# EAGLE design untitled (EAGLE 9.6.2)
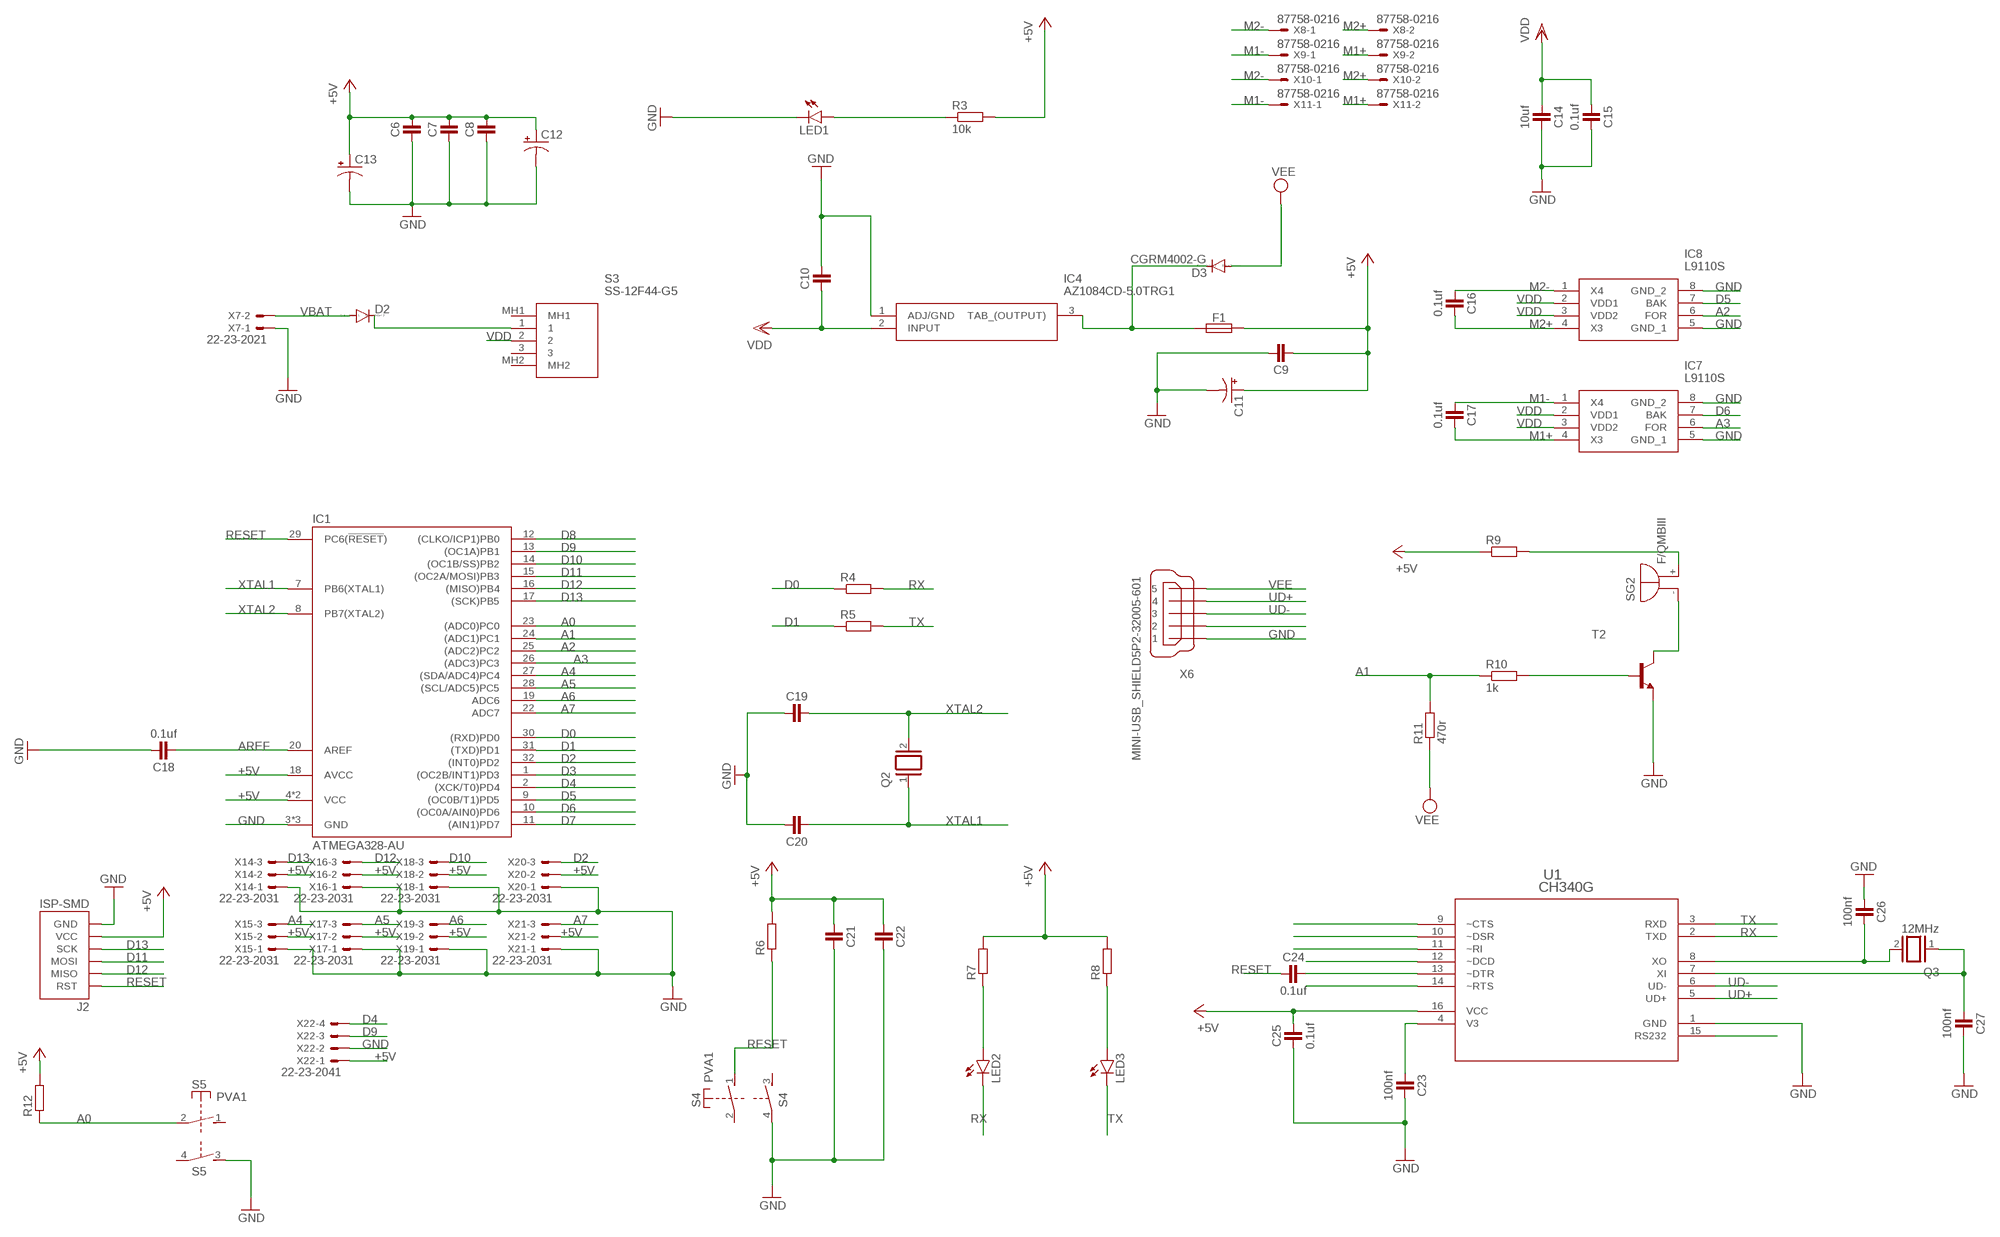
[diagram p0: schematic, sheet 1]

## Parts
C6  CAPACITOR-0603  [C0603]
C7  CAPACITOR-0603  [C0603]
C8  CAPACITOR-0603  [C0603]
C9  CAPACITOR-0603  [C0603]
C10  CAPACITOR-0603  [C0603]
C11  CPOL-USB/3528-21R  [B/3528-21R]
C12  CPOL-USB/3528-21R  [B/3528-21R]
C13  CPOL-USB/3528-21R  [B/3528-21R]
C14  10uf  CAPACITOR-0603  [C0603]
C15  0.1uf  CAPACITOR-0603  [C0603]
C16  0.1uf  CAPACITOR-0603  [C0603]
C17  0.1uf  CAPACITOR-0603  [C0603]
C18  0.1uf  CAPACITOR-0603  [C0603]
C19  CAPACITOR-0603  [C0603]
C20  CAPACITOR-0603  [C0603]
C21  CAPACITOR-0603  [C0603]
C22  CAPACITOR-0603  [C0603]
C23  100nf  CAPACITOR-0603  [C0603]
C24  0.1uf  CAPACITOR-0603  [C0603]
C25  0.1uf  CAPACITOR-0603  [C0603]
C26  100nf  CAPACITOR-0603  [C0603]
C27  100nf  CAPACITOR-0603  [C0603]
D2  DIODE-DO-214AC  [DO-214AC]
D3  CGRM4002-G  [SOD-123_MINI-SMA]
F1  FUSE-1812  [C1812]
IC1  ATMEGA328-AU  [TQFP32]
IC4  AZ1084CD-5.0TRG1  [TO-252_1]
IC7  L9110S  [SOIC127P600X175-8N]
IC8  L9110S  [SOIC127P600X175-8N]
J2  ISP-SMD  [ISP-2X3_SMD]
LED1  LEDCHIPLED_0805  [CHIPLED_0805]
LED2  LEDCHIPLED_0805  [CHIPLED_0805]
LED3  LEDCHIPLED_0805  [CHIPLED_0805]
Q2  XTAL/S  [QS]
Q3  12MHz  XTAL/S  [QS]
R3  10k  R-EU_R0603  [R0603]
R4  R-EU_R0603  [R0603]
R5  R-EU_R0603  [R0603]
R6  R-EU_R0603  [R0603]
R7  R-EU_R0603  [R0603]
R8  R-EU_R0603  [R0603]
R9  R-EU_R0603  [R0603]
R10  1k  R-EU_R0603  [R0603]
R11  470r  R-EU_R0603  [R0603]
R12  R-EU_R0603  [R0603]
S3  SS-12F44-G5  [SS12F44G5]
S4  PVA1  [PVA1F]
S5  PVA1  [PVA1F]
SG2  F/QMBIII  [F/QMBIII]
T2  BC817-NPN-SOT23-BEC  [SOT23-BEC]
U1  CH340G  [SOP16-50-062A]
X6  MINI-USB_SHIELD5P2-32005-601  [32005-601]
X7  22-23-2021  [22-23-2021]
X8  87758-0216  [87758-0216]
X9  87758-0216  [87758-0216]
X10  87758-0216  [87758-0216]
X11  87758-0216  [87758-0216]
X14  22-23-2031  [22-23-2031]
X15  22-23-2031  [22-23-2031]
X16  22-23-2031  [22-23-2031]
X17  22-23-2031  [22-23-2031]
X18  22-23-2031  [22-23-2031]
X19  22-23-2031  [22-23-2031]
X20  22-23-2031  [22-23-2031]
X21  22-23-2031  [22-23-2031]
X22  22-23-2041  [22-23-2041]

## Nets
+5V: C6.2 C7.2 C8.2 C9.1 C11.+ C12.+ C13.+ C21.1 C22.1 C25.2 F1.2 IC1.4(VCC) IC1.6(VCC) IC1.18(AVCC) J2.VCC R3.2 R6.2 R7.2 R8.2 R9.1 R12.2 U1.16(VCC) X14.2 X15.2 X16.2 X17.2 X18.2 X19.2 X20.2 X21.2 X22.1
A0: IC1.23((ADC0)PC0) R12.1 S5.2(1:P)
A1: IC1.24((ADC1)PC1) R10.1 R11.2
A2: IC1.25((ADC2)PC2) IC8.6(FOR)
A3: IC1.26((ADC3)PC3) IC7.6(FOR)
A4: IC1.27((SDA/ADC4)PC4) X15.3
A5: IC1.28((SCL/ADC5)PC5) X17.3
A6: IC1.19(ADC6) X19.3
A7: IC1.22(ADC7) X21.3
AREF: C18.1 IC1.20(AREF)
D0: IC1.30((RXD)PD0) R4.1
D1: IC1.31((TXD)PD1) R5.1
D2: IC1.32((INT0)PD2) X20.3
D3: IC1.1((OC2B/INT1)PD3)
D4: IC1.2((XCK/T0)PD4) X22.4
D5: IC1.9((OC0B/T1)PD5) IC8.7(BAK)
D6: IC1.10((OC0A/AIN0)PD6) IC7.7(BAK)
D7: IC1.11((AIN1)PD7)
D8: IC1.12((CLKO/ICP1)PB0)
D9: IC1.13((OC1A)PB1) X22.3
D10: IC1.14((OC1B/SS)PB2) X18.3
D11: IC1.15((OC2A/MOSI)PB3) J2.MOSI
D12: IC1.16((MISO)PB4) J2.MISO X16.3
D13: IC1.17((SCK)PB5) J2.SCK X14.3
GND: C6.1 C7.1 C8.1 C9.2 C10.2 C11.- C12.- C13.- C14.2 C15.2 C18.2 C19.1 C20.2 C21.2 C22.2 C23.2 C25.1 C26.1 C27.2 IC1.3(GND) IC1.5(GND) IC1.21(GND) IC4.1(ADJ/GND) IC7.5(GND_1) IC7.8(GND_2) IC8.5(GND_1) IC8.8(GND_2) J2.GND LED1.C S4.4(2:P) S5.3(2:S) T2.E U1.1(GND) X6.1 X7.1 X14.1 X15.1 X16.1 X17.1 X18.1 X19.1 X20.1 X21.1 X22.2
M1+: C17.2 IC7.4(X3) X9.2 X11.2
M1-: C17.1 IC7.1(X4) X9.1 X11.1
M2+: C16.2 IC8.4(X3) X8.2 X10.2
M2-: C16.1 IC8.1(X4) X8.1 X10.1
N$1: LED1.A R3.1
N$2: D2.C S3.1
N$3: D3.C F1.1 IC4.3(TAB_(OUTPUT))
N$4: U1.15(RS232)
N$5: LED2.A R7.1
N$6: LED3.A R8.1
N$7: C27.1 Q3.1 U1.7(XI)
N$8: R9.2 SG2.+(-)
N$9: X6.2
N$10: SG2.-(+) T2.C
N$11: R10.2 T2.B
N$12: C26.2 Q3.2 U1.8(XO)
N$15: U1.9(~CTS)
N$16: U1.10(~DSR)
N$17: U1.11(~RI)
N$18: U1.12(~DCD)
N$19: C24.2 U1.13(~DTR)
N$20: U1.14(~RTS)
N$22: C23.1 U1.4(V3)
RESET: C24.1 IC1.29(PC6(!RESET!)) J2.RST R6.1 S4.1(1:S)
RX: LED2.C R4.2 U1.2(TXD)
TX: LED3.C R5.2 U1.3(RXD)
UD+: U1.5(UD+) X6.4
UD-: U1.6(UD-) X6.3
VBAT: D2.A X7.2
VDD: C10.1 C14.1 C15.1 IC4.2(INPUT) IC7.2(VDD1) IC7.3(VDD2) IC8.2(VDD1) IC8.3(VDD2) S3.2
VEE: D3.A R11.1 X6.5
XTAL1: C20.1 IC1.7(PB6(XTAL1)) Q2.1
XTAL2: C19.2 IC1.8(PB7(XTAL2)) Q2.2
Unconnected: S3.3 S3.MH1 S3.MH2 S4.2(1:P) S4.3(2:S) S5.1(1:S) S5.4(2:P) X6.M1(S1) X6.M2(S2)

## Library data of the parts
C6-C10 C14-C27 = we-rcl:CAPACITOR: Capacitors ...2.2uF @ 6.3V -> 0402 ...4.7uF @ 6.3V -> 0603 ...10uF @ 16V -> 0805 ...22uF @ 25V -> 1206
C11-C13 = rcl:CPOL-US: POLARIZED CAPACITOR, American symbol; SPICEPREFIX: C
D2 = diode:DIODE-: DIODE
D3 = diode:CGRM400*-G: Molded plasitc,JEDEC SOD-123/Mini SMA Source: Comchip CGRM4001-G.pdf
F1 = we-rcl:FUSE: Fuses
IC1 = we-chip:ATMEGA328: Atmel ATmega48/88/168/328 AVR Microcontroller
IC4 = AZ1084CD-5.0TRG1:AZ1084CD-5.0TRG1: LDO Voltage Regulators LDO BJT HiCurr Source: Datasheet <https://www.diodes.com/assets/Datasheets/AZ1084C.pdf>; ARROW_PART_NUMBER: AZ1084CD-5.0TRG1; ARROW_PRICE-STOCK: https://www.arrow.com/en/products/az1084cd-5.0trg1/diodes-incorporated; DESCRIPTION: LDO Voltage Regulators LDO BJT HiCurr; HEIGHT: mm; MANUFACTURER_NAME: Diodes Inc.; MANUFACTURER_PART_NUMBER: AZ1084CD-5.0TRG1; MOUSER_PART_NUMBER: 621-AZ1084CD-5.0TRG1; MOUSER_PRICE-STOCK: https://www.mouser.co.uk/ProductDetail/Diodes-Incorporated/AZ1084CD-50TRG1?qs=5V6w%252Be2aIqY1QaMHWnvTJw%3D%3D
IC7 IC8 = L9110S:L9110S: Motor Drivers SOP-8_150mil RoHS Source: Datasheet <https://datasheet.lcsc.com/szlcsc/Wuxi-Zhongwei-Aisin-Elec-L9110S_C85174.pdf>; DESCRIPTION: Motor Drivers SOP-8_150mil RoHS; HEIGHT: 1.75mm; MANUFACTURER_NAME: Wuxi I-core Elec; MANUFACTURER_PART_NUMBER: L9110S
J2 = we-board:ISP: AVR ISP connector
LED1-LED3 = led:LED: LED OSRAM: - CHIPLED LG R971, LG N971, LY N971, LG Q971, LY Q971, LO R971, LY R971 LH N974, LH R974 LS Q976, LO Q976, LY Q976 LO Q996 - Hyper CHIPLED LW Q18S LB Q993, LB Q99A, LB R99A - SideLED LS A670, LO A670, LY A670, LG A670, LP A670 LB A673, LV A673, LT A673, LW A673 LH A674 LY A675 LS A676, LA A676, LO A676, LY A676, LW A676 LS A679, LY A679, LG A679 - Hyper Micro SIDELED® LS Y876, LA Y876, LO Y876, LY Y876 LT Y87S - SmartLED LW L88C, LW L88S LB L89C, LB L89S, LG L890 LS L89K, LO L89K, LY L89K LS L896, LA L896, LO L896, LY L896 - TOPLED LS T670, LO T670, LY T670, LG T670, LP T670 LSG T670, LSP T670, LSY T670, LOP T670, LYG T670 LG T671, LOG T671, LSG T671 LB T673, LV T673, LT T673, LW T673 LH T674 LS T676, LA T676, LO T676, LY T676, LB T676, LH T676, LSB T676, LW T676 LB T67C, LV T67C, LT T67C, LS T67K, LO T67K, LY T67K, LW E67C LS E67B, LA E67B, LO E67B, LY E67B, LB E67C, LV E67C, LT E67C LW T67C LS T679, LY T679, LG T679 LS T770, LO T770, LY T770, LG T770, LP T770 LB T773, LV T773, LT T773, LW T773 LH T774 LS E675, LA E675, LY E675, LS T675 LS T776, LA T776, LO T776, LY T776, LB T776 LHGB T686 LT T68C, LB T68C - Hyper Mini TOPLED® LB M676 - Mini TOPLED Santana® LG M470 LS M47K, LO M47K, LY M47K Source: http://www.osram.convergy.de LUXEON: - LUMILED® LXK2-PW12-R00, LXK2-PW12-S00, LXK2-PW14-U00, LXK2-PW14-V00 LXK2-PM12-R00, LXK2-PM12-S00, LXK2-PM14-U00 LXK2-PE12-Q00, LXK2-PE12-R00, LXK2-PE12-S00, LXK2-PE14-T00, LXK2-PE14-U00 LXK2-PB12-K00, LXK2-PB12-L00, LXK2-PB12-M00, LXK2-PB14-N00, LXK2-PB14-P00, LXK2-PB14-Q00 LXK2-PR12-L00, LXK2-PR12-M00, LXK2-PR14-Q00, LXK2-PR14-R00 LXK2-PD12-Q00, LXK2-PD12-R00, LXK2-PD12-S00 LXK2-PH12-R00, LXK2-PH12-S00 LXK2-PL12-P00, LXK2-PL12-Q00, LXK2-PL12-R00 Source: www.luxeon.com KINGBRIGHT: KA-3528ASYC Source: www.kingbright.com
Q2 Q3 = special:XTAL/S: CRYSTAL
R3-R12 = rcl:R-EU_: RESISTOR, European symbol; SPICEPREFIX: R
S3 = SS-12F44-G5:SS-12F44-G5: Toggle Switches Plugin RoHS Source: Datasheet <https://datasheet.lcsc.com/szlcsc/Korean-Hroparts-Elec-SS-12F44-G5_C136718.pdf>; DESCRIPTION: Toggle Switches Plugin RoHS; HEIGHT: 11mm; MANUFACTURER_NAME: Korean Hroparts Elec; MANUFACTURER_PART_NUMBER: SS-12F44-G5
S4 S5 = switch-misc:PVA1: ITT SWITCH
SG2 = buzzer:F/QMBIII: BUZZER Source: Buerklin; OC_FARNELL: unknown; OC_NEWARK: unknown
T2 = transistor-neu-to92:*-NPN-: NPN Transistror
U1 = ch340g:CH340G; CHCODE: INTUP000002; DESIGNER: CHIPHOME; DEVICE: CH340G; FOOTPRINT: sop16-50-062a
X6 = con-cypressindustries:MINI-USB_SHIELD5P2-: MINI USB-B R/A DIP 5pol. Source: www.cypressindustries.com; OC_FARNELL: unknown; OC_NEWARK: unknown
X7 = con-molex:22-23-2021: .100" (2.54mm) Center Header - 2 Pin; MF: MOLEX; MPN: 22-23-2021; OC_FARNELL: 1462926; OC_NEWARK: 25C3832
X8-X11 = con-molex:87758-0216: 2 Pin - 2mm Dual Row Single Wafer, Vertical T/H HDR Source: http://www.molex.com/pdm_docs/sd/877580616_sd.pdf; MF: MOLEX; MPN: 87758-0216; OC_FARNELL: unknown; OC_NEWARK: 94M1513
X14-X21 = con-molex:22-23-2031: .100" (2.54mm) Center Header - 3 Pin; MF: MOLEX; MPN: 22-23-2031; OC_FARNELL: 1462950; OC_NEWARK: 30C0862
X22 = con-molex:22-23-2041: .100" (2.54mm) Center Header - 4 Pin; MF: MOLEX; MPN: 22-23-2041; OC_FARNELL: 1462920; OC_NEWARK: 38C0355

## Board
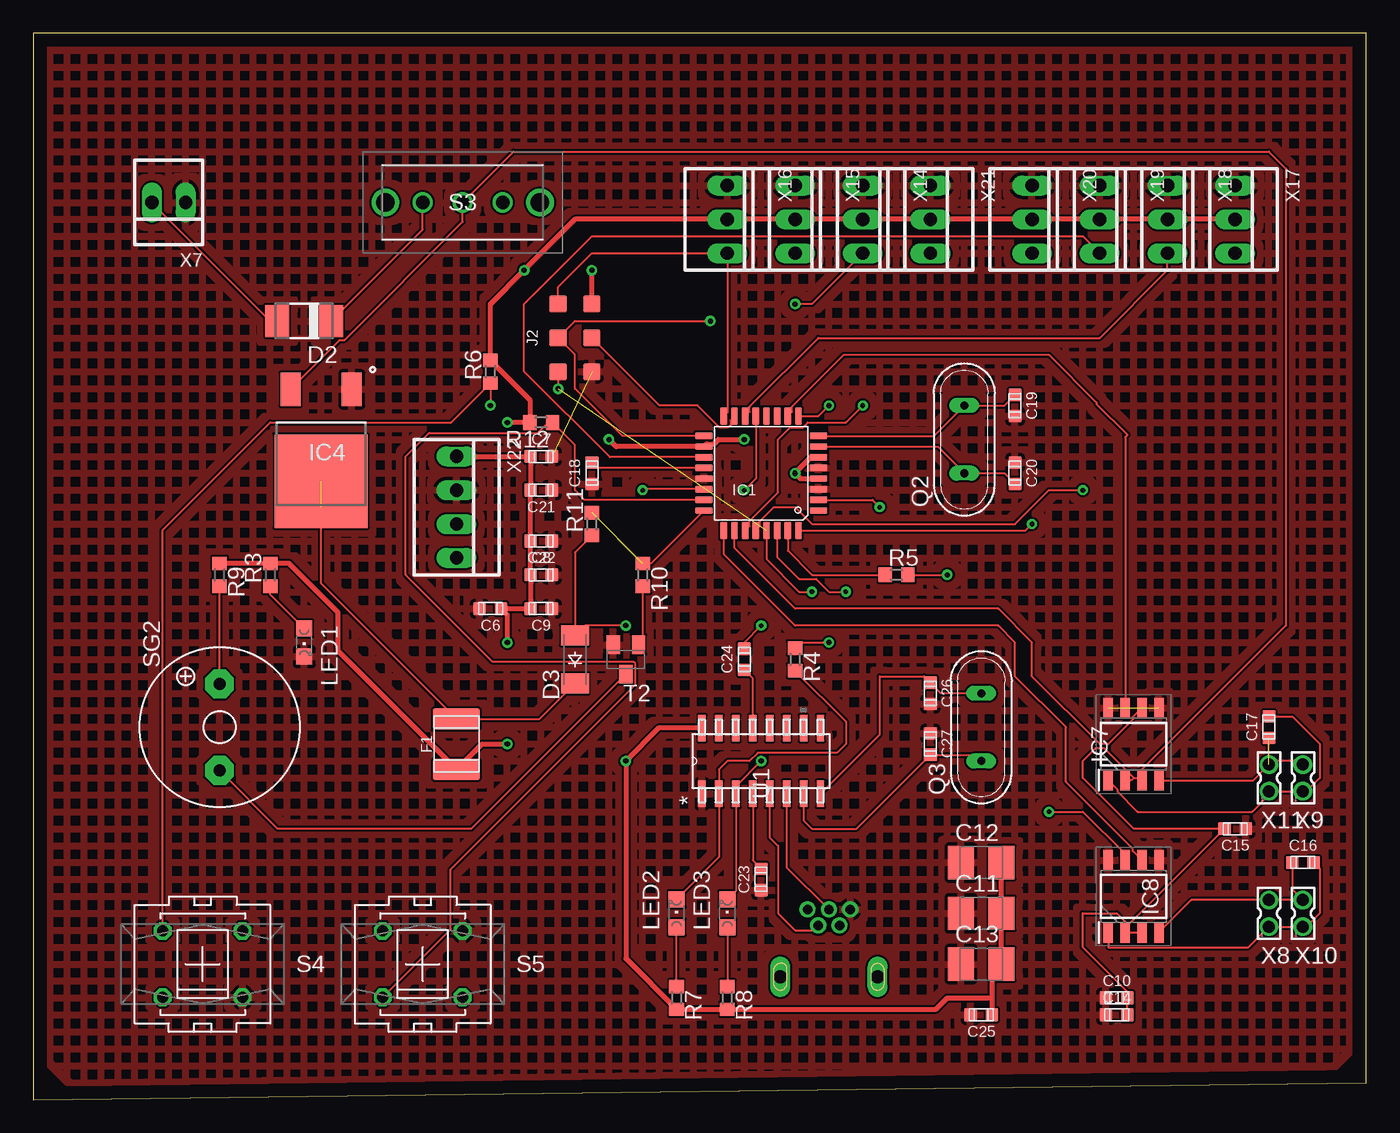
[diagram p1: board, top side]
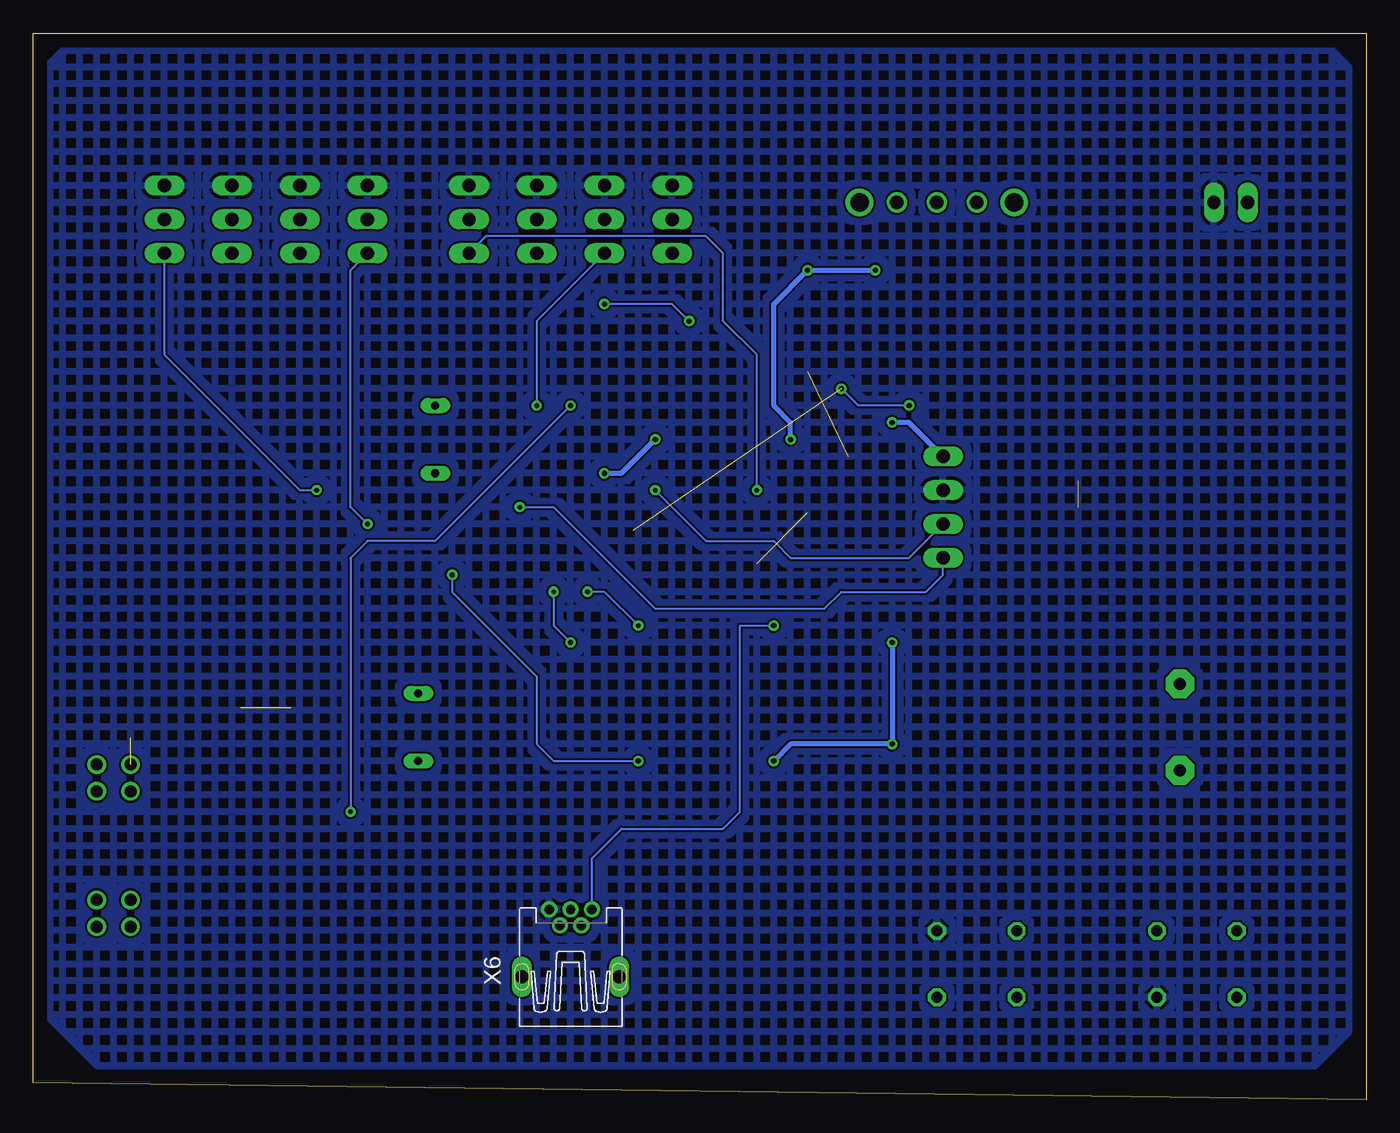
[diagram p2: board, bottom side, seen from below]

Size 100 x 80 mm. Coordinates in mm from the lower left corner, seen from the top.
Outline: 0,0 100,1.27 100,80 0,80 0,0
Copper layers (1*16): Top 0.035mm / dielectric 1.5mm / Bottom 0.035mm
Design rules "default": minimum track width 6mil, minimum drill 0.35mm, track to track 6mil, track to pad 6mil, pad to pad 6mil, via to via 6mil, smd to smd 6mil, copper to edge 40mil, drill to drill 6mil, minimum pad ring 10mil, minimum via ring 8mil, stop-mask expansion 4mil, vias tented up to drill 0mil, thermal gap 10mil

### Footprints (pad centres in the part's own frame; a part is rotated, then mirrored left to right if it is on the bottom)
C0603 = smd 1 x 0.95: 1 0,0.8; 2 0,-0.8
B/3528-21R = smd 1.95 x 2.5: + 1.525,0; - -1.525,0
DO-214AC = smd 1.8 x 2.4: A 2.025,0; C -2.025,0
SOD-123_MINI-SMA = smd 1.5 x 2.1: A 1.8,0; C -1.8,0
C1812 = smd 3.5 x 1.6: 1 0,1.9; 2 0,-1.9
TQFP32 = smd 1.27 x 0.5: 1 -4.293,2.8; 2 -4.293,2; 3 -4.293,1.2; 4 -4.293,0.4; 5 -4.293,-0.4; 6 -4.293,-1.2; 7 -4.293,-2; 8 -4.293,-2.8; 17 4.293,-2.8; 18 4.293,-2; 19 4.293,-1.2; 20 4.293,-0.4; 21 4.293,0.4; 22 4.293,1.2; 23 4.293,2; 24 4.293,2.8 | smd 0.5 x 1.27: 9 -2.8,-4.293; 10 -2,-4.293; 11 -1.2,-4.293; 12 -0.4,-4.293; 13 0.4,-4.293; 14 1.2,-4.293; 15 2,-4.293; 16 2.8,-4.293; 25 2.8,4.293; 26 2,4.293; 27 1.2,4.293; 28 0.4,4.293; 29 -0.4,4.293; 30 -1.2,4.293; 31 -2,4.293; 32 -2.8,4.293
TO-252_1 = smd 1.5 x 2.5: 1 -2.3,-2.493; 2 2.3,-2.493 | smd 7 x 7: 3 0,4.407
SOIC127P600X175-8N = smd 1.525 x 0.7: 1 -2.712,1.905; 2 -2.712,0.635; 3 -2.712,-0.635; 4 -2.712,-1.905; 5 2.712,-1.905; 6 2.712,-0.635; 7 2.712,0.635; 8 2.712,1.905
ISP-2X3_SMD = smd 1.27 x 1.27: GND 1.27,-2.54; MISO -1.27,2.54; MOSI 1.27,0; RST -1.27,-2.54; SCK -1.27,0; VCC 1.27,2.54
CHIPLED_0805 = smd 1.2 x 1.2: A 0,-1.05; C 0,1.05
QS = drill 0.61 long: 1 -2.54,0; 2 2.54,0
R0603 = smd 1 x 1.1: 1 -0.85,0; 2 0.85,0
SS12F44G5 = drill 1.01 pad 1.4: 1 0,0; 2 3,0; 3 6,0 | drill 1.393 pad 2: MH1 -2.8,0; MH2 8.8,0
PVA1F = drill 0.813 octagon: 1 -2.997,2.489; 2 -2.997,-2.489; 3 2.997,2.489; 4 2.997,-2.489
F/QMBIII = drill 0.914 pad 2.159 octagon: + 3.251,0; - -3.251,0
SOT23-BEC = smd 1 x 1.4: B -0.95,-1.1; C 0,1.1; E 0.95,-1.1
SOP16-50-062A = smd 1.981 x 0.559: 1 -2.465,4.445; 2 -2.465,3.175; 3 -2.465,1.905; 4 -2.465,0.635; 5 -2.465,-0.635; 6 -2.465,-1.905; 7 -2.465,-3.175; 8 -2.465,-4.445; 9 2.465,-4.445; 10 2.465,-3.175; 11 2.465,-1.905; 12 2.465,-0.635; 13 2.465,0.635; 14 2.465,1.905; 15 2.465,3.175; 16 2.465,4.445
32005-601 = drill 0.7 pad 1.016: 1 2.825,1.6; 2 1.625,0.8; 3 2.825,0; 4 1.625,-0.8; 5 2.825,-1.6 | drill 1 pad 1.422 long: M1 -2.225,3.65; M2 -2.225,-3.65
22-23-2021 = drill 1 long: 1 -1.27,0; 2 1.27,0
87758-0216 = drill 0.9 pad 1.27: 1 0,-1; 2 0,1
22-23-2031 = drill 1 long: 1 -2.54,0; 2 0,0; 3 2.54,0
22-23-2041 = drill 1 long: 1 -3.81,0; 2 -1.27,0; 3 1.27,0; 4 3.81,0

### Placement (x,y rotation side)
C6  34.29,36.83 90 top
C7  38.1,48.26 270 top
C8  38.1,39.37 270 top
C9  38.1,36.83 90 top
C10  81.28,7.62 270 top
C11  71.12,13.97 0 top
C12  71.12,17.78 0 top
C13  71.12,10.16 0 top
C14  81.28,6.35 270 top
C15  90.17,20.32 90 top
C16  95.25,17.78 270 top
C17  92.71,27.94 0 top
C18  41.91,46.99 0 top
C19  73.66,52.07 180 top
C20  73.66,46.99 180 top
C21  38.1,45.72 90 top
C22  38.1,41.91 90 top
C23  54.61,16.51 0 top
C24  53.34,33.02 0 top
C25  71.12,6.35 90 top
C26  67.31,30.48 180 top
C27  67.31,26.67 180 top
D2  20.32,58.42 180 top
D3  40.64,33.02 90 top
F1  31.75,26.67 0 top
IC1  54.61,46.99 180 top
IC4  21.59,50.8 180 top
IC7  82.55,26.67 90 top
IC8  82.55,15.24 90 top
J2  40.64,57.15 0 top
LED1  20.32,34.29 180 top
LED2  48.26,13.97 0 top
LED3  52.07,13.97 0 top
Q2  69.85,49.53 90 top
Q3  71.12,27.94 90 top
R3  17.78,39.37 90 top
R4  57.15,33.02 270 top
R5  64.77,39.37 0 top
R6  34.29,54.61 90 top
R7  48.26,7.62 270 top
R8  52.07,7.62 270 top
R9  13.97,39.37 270 top
R10  45.72,39.37 270 top
R11  41.91,43.18 90 top
R12  38.1,50.8 180 top
S3  29.21,67.31 0 top
S4  12.7,10.16 0 top
S5  29.21,10.16 0 top
SG2  13.97,27.94 90 top
T2  44.45,33.02 180 top
U1  54.61,25.4 90 top
X6  59.69,11.43 90 bottom
X7  10.16,67.31 180 top
X8  92.71,13.97 0 top
X9  95.25,24.13 0 top
X10  95.25,13.97 0 top
X11  92.71,24.13 0 top
X14  62.23,66.04 270 top
X15  57.15,66.04 270 top
X16  52.07,66.04 270 top
X17  90.17,66.04 270 top
X18  85.09,66.04 270 top
X19  80.01,66.04 270 top
X20  74.93,66.04 270 top
X21  67.31,66.04 270 top
X22  31.75,44.45 270 top

### Tracks (layer width: path | path; a pad name or v marks a point on that pad's centre or on a via)
+5V  (via drill 0.38)
  Top 0.381: R9.1 R3.2 19.18,40.22 22.86,36.54 22.86,33.66 F1.2 33.65,26.67 v35.56,26.67 | C12.+ C11.+ C13.+ 71.92,9.44 71.92,7.62 | 71.92,7.62 C25.2 | X22.1 C7.2 C21.1 C22.1 C8.2 C9.1 C6.2 35.56,36.36 v35.56,34.29 | J2.VCC v41.91,62.23 | IC1.6 58.35,48.19 v57.15,46.99 57.55,46.59 IC1.4 | v43.18,49.53 43.72,48.99 IC1.18 50.52,49.2 51.06,49.2 51.4,49.53 v53.34,49.53 | U1.16 46.91,27.86 v44.45,25.4 44.45,10.58 R7.2 R8.2 67.73,6.77 68.58,7.62 71.92,7.62 | X17.2 X18.2 X19.2 X20.2 X21.2 X14.2 X15.2 X16.2 40.64,66.04 v36.83,62.23 34.29,59.69 R6.2 37.25,52.5 R12.2 v35.56,50.8
  Bottom 0.381: v36.83,62.23 v41.91,62.23 44.45,59.69 44.45,52.07 43.18,50.8 v43.18,49.53 | v35.56,34.29 v35.56,26.67 43.18,26.67 v44.45,25.4 | X22.1 34.29,50.8 v35.56,50.8 | v57.15,46.99 55.88,46.99 v53.34,49.53
A0
  Top 0.152: IC1.23 41.37,44.99 40.64,45.72 40.64,49.11 39.16,50.59 | 39.16,50.59 R12.1 | S5.2 31.32,12.78 31.32,17.27 45.18,31.12 45.18,32.72 45.05,32.85 34.46,32.85 27.94,39.37 27.94,48.26 29.7,50.02 37.84,50.02 38.41,50.59 39.16,50.59
A1  (1 unrouted)
  Top 0.152: IC1.24 46.35,40.22 R10.1
A2
  Top 0.152: IC8.6 82.49,18.64 82.49,18.81 77.47,23.83 77.47,27.94 73.66,31.75 73.66,34.29 72.39,35.56 57.15,35.56 51.81,40.9 IC1.25
A3
  Top 0.152: IC7.6 82.49,28.69 82.49,28.52 80.64,26.67 80.01,26.67 74.93,31.75 74.93,34.29 72.39,36.83 57.15,36.83 52.61,41.37 IC1.26
A4  (via drill 0.35)
  Top 0.152: IC1.27 53.73,43.02 53.73,43.4 55.88,45.55 55.88,49.53 56.77,50.42 57.73,50.42 58.11,50.8 60.96,50.8 v62.23,52.07
  Bottom 0.152: X15.3 62.23,58.42 v62.23,52.07
A5  (via drill 0.35)
  Top 0.152: IC1.28 54.53,43.02 54.53,43.4 55.58,44.45 57.15,44.45 58.42,43.18 73.66,43.18 76.2,45.72 v78.74,45.72
  Bottom 0.152: X17.3 90.17,55.88 80.01,45.72 v78.74,45.72
A6
  Top 0.152: IC1.19 43.25,48.19 36.83,54.61 36.83,59.69 41.91,64.77 78.74,64.77 X19.3
A7  (via drill 0.35)
  Top 0.152: IC1.22 45.79,45.79 v45.72,45.72
  Bottom 0.152: v45.72,45.72 45.72,55.88 48.26,58.42 48.26,63.5 49.53,64.77 66.04,64.77 X21.3
AREF
  Top 0.152: IC1.20 42.31,47.39 C18.1
D0  (via drill 0.35)
  Top 0.152: IC1.30 55.81,40.71 57.45,39.06 58.73,39.06 59.69,38.1 v60.96,38.1 | R4.1 57.57,34.29 v59.69,34.29
  Bottom 0.152: v60.96,38.1 60.96,35.56 v59.69,34.29
D1
  Top 0.152: IC1.31 56.61,41.18 58.42,39.37 R5.1
D2  (via drill 0.35)
  Top 0.152: IC1.32 74.45,42.7 v74.93,43.18
  Bottom 0.152: v74.93,43.18 76.2,44.45 76.2,62.23 X20.3
D4  (via drill 0.35)
  Top 0.152: IC1.2 62.96,44.99 v63.5,44.45
  Bottom 0.152: v63.5,44.45 60.96,44.45 53.34,36.83 40.64,36.83 39.37,38.1 33.02,38.1 31.75,39.37 X22.4
D5  (via drill 0.35)
  Top 0.152: IC1.9 58.9,51.28 v59.69,52.07 | v76.2,21.59 78.74,21.59 81.92,18.41 IC8.7
  Bottom 0.152: v59.69,52.07 69.85,41.91 74.93,41.91 76.2,40.64 v76.2,21.59
D6
  Top 0.152: IC1.10 56.93,51.6 56.93,51.98 60.83,55.88 76.2,55.88 79.77,52.31 79.77,52.2 82.09,49.88 81.92,49.7 IC7.7
D9  (via drill 0.35)
  Top 0.152: IC1.13 54.21,46.59 v53.34,45.72
  Bottom 0.152: v53.34,45.72 49.53,41.91 44.45,41.91 43.18,40.64 34.29,40.64 X22.3
D10
  Top 0.152: IC1.14 53.73,51.6 53.73,51.98 58.9,57.15 80.01,57.15 85.09,62.23 X18.3
D11
  Top 0.152: IC1.15 52.29,50.96 52.29,50.58 52.12,50.42 51.49,50.42 49.84,52.07 46.99,52.07 J2.MOSI
D12
  Top 0.152: IC1.16 52.07,51.54 X16.3 41.91,63.5 39.37,60.96 J2.MISO
D13  (via drill 0.38)
  Top 0.152: IC1.17 44.19,49.79 40.64,53.34 40.64,55.88 J2.SCK 40.64,58.42 v50.8,58.42 | X14.3 58.42,59.69 v57.15,59.69
  Bottom 0.152: v50.8,58.42 52.07,59.69 v57.15,59.69
GND  (2 unrouted)
  pour Top (hatched): 0,78.74 1.27,80.01 97.79,80.01 100.33,77.47 100.33,5.08 96.52,1.27 2.54,1.27 0,3.81
  pour Bottom (hatched): 1.27,77.47 2.54,78.74 3.81,78.74 97.79,78.74 99.06,77.47 99.06,6.35 95.25,2.54 3.81,2.54 1.27,5.08
M1+  (1 unrouted)
  Top 0.152: IC7.4 91.54,23.96 X11.2 | X9.2 94.98,25.4 92.71,25.4 C17.2
M1-
  Top 0.152: IC7.1 81.34,23.27 81.34,23.1 82.85,21.59 91.44,21.59 92.71,22.86 X11.1 X9.1 95.52,23.13 96.52,24.13 96.52,26.67 94.45,28.74 C17.1
M2+
  Top 0.152: IC8.4 86.9,14.97 X8.2 X10.2 94.45,15.77 C16.2
M2-
  Top 0.152: IC8.1 80.64,11.43 91.17,11.43 X8.1 X10.1 95.52,12.97 96.52,13.97 96.52,17.31 C16.1
N$1
  Top 0.152: LED1.A 17.78,37.88 R3.1
N$2
  Top 0.152: D2.C 29.21,65.28 S3.1
N$3  (1 unrouted)
  Top 0.152: 21.59,44.45 21.59,38.73 F1.1 37.99,28.57 D3.C
  Top 0.381: F1.1 31.75,27.94
N$5
  Top 0.152: R7.1 LED2.A
N$6
  Top 0.152: LED3.A R8.1
N$7
  Top 0.152: U1.7 57.78,20.95 58.42,20.32 61.76,20.32 C27.1 70.65,25.87 Q3.1
N$8
  Top 0.152: SG2.+ R9.2
N$10
  Top 0.152: T2.C 32.85,20.32 18.34,20.32 SG2.-
N$11
  Top 0.152: R10.2 45.72,34.44 T2.B
N$12
  Top 0.152: U1.8 63.5,27.38 63.5,31.75 66.84,31.75 C26.2 68.11,30.48 Q3.2
N$19
  Top 0.152: U1.13 53.98,31.59 C24.2
N$22
  Top 0.152: U1.4 53.98,17.95 C23.1
RESET  (via drill 0.35, 0.38)  (1 unrouted)
  Top 0.152: IC1.29 55.01,40.55 57.45,38.1 v58.42,38.1 | C24.1 53.34,34.29 v54.61,35.56 | S4.1 9.7,42.72 17.78,50.8 31.33,50.8 R6.1 v34.29,52.07 | J2.RST v39.37,53.34
  Bottom 0.152: v54.61,35.56 57.15,38.1 v58.42,38.1 | v34.29,52.07 38.1,52.07 v39.37,53.34
RX
  Top 0.152: LED2.C 51.44,18.2 U1.2 51.44,24.77 52.07,25.4 53.73,25.4 54.35,26.02 60.31,26.02 60.96,26.67 60.96,28.36 R4.2
TX  (via drill 0.38)
  Top 0.152: LED3.C 52.7,15.65 52.7,22.86 U1.3 52.7,23.5 v54.61,25.4 | R5.2 v68.58,39.37
  Bottom 0.152: v68.58,39.37 68.58,38.1 62.23,31.75 62.23,26.67 60.96,25.4 v54.61,25.4
UD+
  Top 0.152: U1.5 55.24,19.68 55.88,19.05 55.88,13.97 57.15,12.7 58.53,12.7 X6.4
UD-
  Top 0.152: U1.6 56.52,17.43 X6.3
VBAT
  Top 0.152: D2.A 17.78,58.42 X7.2
VDD
  Top 0.152: IC4.2 22.99,56.99 23.34,56.99 32.21,65.86 S3.2 36.02,71.12 92.71,71.12 93.98,69.85 93.98,35.56 83.19,24.77 83.19,24.13 | 83.19,24.13 IC7.3 | 82.15,13.1 C15.1 82.55,20.32 78.74,24.13 78.74,25.4 79.7,26.36 80.31,26.36 82.55,24.13 | 82.15,13.1 81.92,12.87 IC8.2 IC8.3 | 82.15,13.1 81.28,13.97 78.74,13.97 78.74,11.43 82.08,8.09 C10.1 C14.1 | 82.55,24.13 83.19,24.13 | 82.55,24.13 82.38,23.96 IC7.2
VEE  (via drill 0.38)
  Top 0.152: R11.1 40.64,41.06 D3.A 41.38,35.56 v44.45,35.56
  Bottom 0.152: X6.5 58.09,18.11 55.88,20.32 48.26,20.32 46.99,21.59 46.99,35.56 v44.45,35.56
XTAL1
  Top 0.152: IC1.7 67.85,48.99 Q2.1 72.86,46.99 C20.1
XTAL2
  Top 0.152: IC1.8 67.57,49.79 Q2.2 72.86,52.07 C19.2